# Altium schematic sheet 09_POWER.SchDoc
size 297 x 209 mm
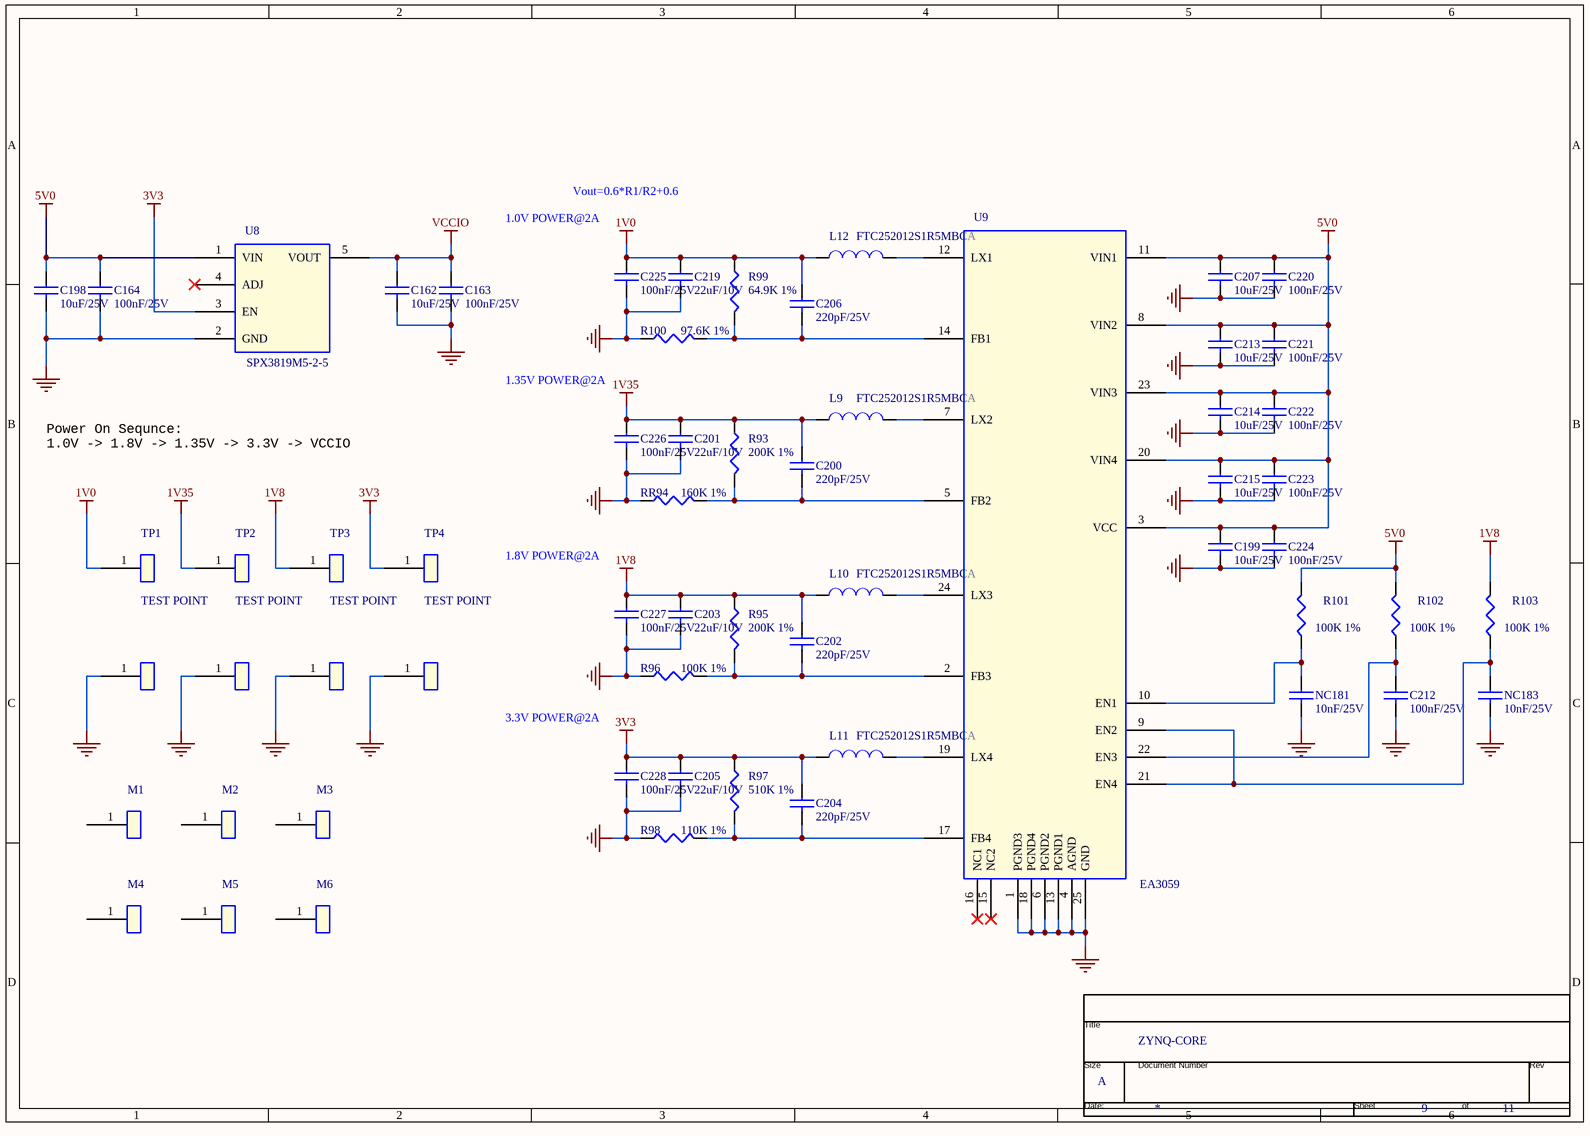
[diagram p0: 09_POWER.SchDoc]

## Parts
*  Page Count: 11  Page Number: 9  Page Size: A  Title: ZYNQ-CORE  (hidden comment: TitleBlock0)  (graphical)
C162  10uF/25V  [C0603]
C163  100nF/25V  [C0402]
C164  100nF/25V  [C0402]
C198  10uF/25V  [C0603]
C199  10uF/25V  [C0603]
C200  220pF/25V  [C0402]
C201  22uF/10V  [C0603]
C202  220pF/25V  [C0402]
C203  22uF/10V  [C0603]
C204  220pF/25V  [C0402]
C205  22uF/10V  [C0603]
C206  220pF/25V  [C0402]
C207  10uF/25V  [C0603]
C212  100nF/25V  [C0603]
C213  10uF/25V  [C0603]
C214  10uF/25V  [C0603]
C215  10uF/25V  [C0603]
C219  22uF/10V  [C0603]
C220  100nF/25V  [C0402]
C221  100nF/25V  [C0402]
C222  100nF/25V  [C0402]
C223  100nF/25V  [C0402]
C224  100nF/25V  [C0402]
C225  100nF/25V  [C0402]
C226  100nF/25V  [C0402]
C227  100nF/25V  [C0402]
C228  100nF/25V  [C0402]
H1  H1  [HOLE3_8D2_6MM]  (value not drawn)
H2  H2  [HOLE3_8D2_6MM]  (value not drawn)
H3  H3  [HOLE3_8D2_6MM]  (value not drawn)
H4  H4  [HOLE3_8D2_6MM]  (value not drawn)
L9  FTC252012S1R5MBCA  [2520]
L10  FTC252012S1R5MBCA  [2520]
L11  FTC252012S1R5MBCA  [2520]
L12  FTC252012S1R5MBCA  [2520]
M1  MARK  [Mark]  (value not drawn)
M2  MARK  [Mark]  (value not drawn)
M3  MARK  [Mark]  (value not drawn)
M4  MARK  [Mark]  (value not drawn)
M5  MARK  [Mark]  (value not drawn)
M6  MARK  [Mark]  (value not drawn)
NC181  10nF/25V  [C0603]
NC183  10nF/25V  [C0603]
R93  200K 1%  [R0402]
R95  200K 1%  [R0402]
R96  100K 1%  [R0402]
R97  510K 1%  [R0402]
R98  110K 1%  [R0402]
R99  64.9K 1%  [R0402]
R100  97.6K 1%  [R0402]
R101  100K 1%  [R0402]
R102  100K 1%  [R0402]
R103  100K 1%  [R0402]
RR94  160K 1%  [R0402]
TP1  TEST POINT  [FPAD_1]
TP2  TEST POINT  [FPAD_1]
TP3  TEST POINT  [FPAD_1]
TP4  TEST POINT  [FPAD_1]
U8  SPX3819M5-2-5  [SOT-23-5]
U9  EA3059  [QFN24_RTW]

## Nets
1V0: C206.1 C219.1 C225.1 L12.1 R99.1 TP1.1
1V8: C202.1 C203.1 C227.1 L10.1 R95.1 R103.2 TP3.1
1V35: C200.1 C201.1 C226.1 L9.1 R93.1 TP2.1
3V3: C204.1 C205.1 C228.1 L11.1 R97.1 TP4.1 U8.3(EN)
5V0: C164.1 C198.1 C199.1 C207.1 C213.1 C214.1 C215.1 C220.1 C221.1 C222.1 C223.1 C224.1 R101.2 R102.2 U8.1(VIN) U9.3(VCC) U9.8(VIN2) U9.11(VIN1) U9.20(VIN4) U9.23(VIN3)
GND: C162.2 C163.2 C164.2 C198.2 C199.2 C201.2 C203.2 C205.2 C207.2 C212.2 C213.2 C214.2 C215.2 C219.2 C220.2 C221.2 C222.2 C223.2 C224.2 C225.2 C226.2 C227.2 C228.2 H1.1 H2.1 H3.1 H4.1 NC181.2 NC183.2 R96.1 R98.1 R100.1 RR94.1 U8.2(GND) U9.1(PGND3) U9.4(AGND) U9.6(PGND2) U9.13(PGND1) U9.18(PGND4) U9.25(GND)
VCCIO: C162.1 C163.1 U8.5(VOUT)
NetC200_2: C200.2 R93.2 RR94.2 U9.5(FB2)
NetC202_2: C202.2 R95.2 R96.2 U9.2(FB3)
NetC204_2: C204.2 R97.2 R98.2 U9.17(FB4)
NetC206_2: C206.2 R99.2 R100.2 U9.14(FB1)
NetC212_1: C212.1 R102.1 U9.22(EN3)
NetL9_2: L9.2 U9.7(LX2)
NetL10_2: L10.2 U9.24(LX3)
NetL11_2: L11.2 U9.19(LX4)
NetL12_2: L12.2 U9.12(LX1)
NetNC181_1: NC181.1 R101.1 U9.10(EN1)
NetNC183_1: NC183.1 R103.1 U9.9(EN2) U9.21(EN4)

Not connected (* = marked no-connect by the designer): M1 1; M2 1; M3 1; M4 1; M5 1; M6 1; U8 4(ADJ)*; U9 15(NC2)* 16(NC1)*

## Notes on the sheet
- Vout=0.6*R1/R2+0.6
- 1.0V POWER@2A
- 1.35V POWER@2A
- Power On Sequnce:
  1.0V -> 1.8V -> 1.35V -> 3.3V -> VCCIO
- 1.8V POWER@2A
- 3.3V POWER@2A
- (in symbol TitleBlock0) Title; Size; Document Number; Rev; Date:; Sheet; of

## Library data of the parts
C162-C164 C198-C207 C213-C215 C219-C228 = CAP NP
  C162 C198 C199 C201 C203 C205 C207 C213-C215 C219: PCB Footprint: C0603
  C163 C164 C200 C202 C204 C206 C220-C228: PCB Footprint: C0402
C212 = CAP NP: 0603; PCB Footprint: C0402
H1-H4 = TEST POINT: PCB Footprint: HOLE3_8D2_6MM
L9-L12 = INDUCTOR: 1.5uH; PCB Footprint: 2520
M1-M6 = TEST POINT: PCB Footprint: FPAD_1
NC181 NC183 = CAP NP: PCB Footprint: C0402
R93 R95-R103 RR94 = RESISTOR: PCB Footprint: R0402
* = TitleBlock0: Page Create Date: March  8, 1995; Page Modify Date: *
TP1-TP4 = TEST POINT: PCB Footprint: FPAD_1
U8 = SPX3819M5-2-5: PCB Footprint: SOT-23-5
U9 = EA3059: PCB Footprint: QFN24_RTW